# Altium schematic sheet Debug_Flash.SchDoc
size A3; SheetNumber: 9; SheetTotal: 10
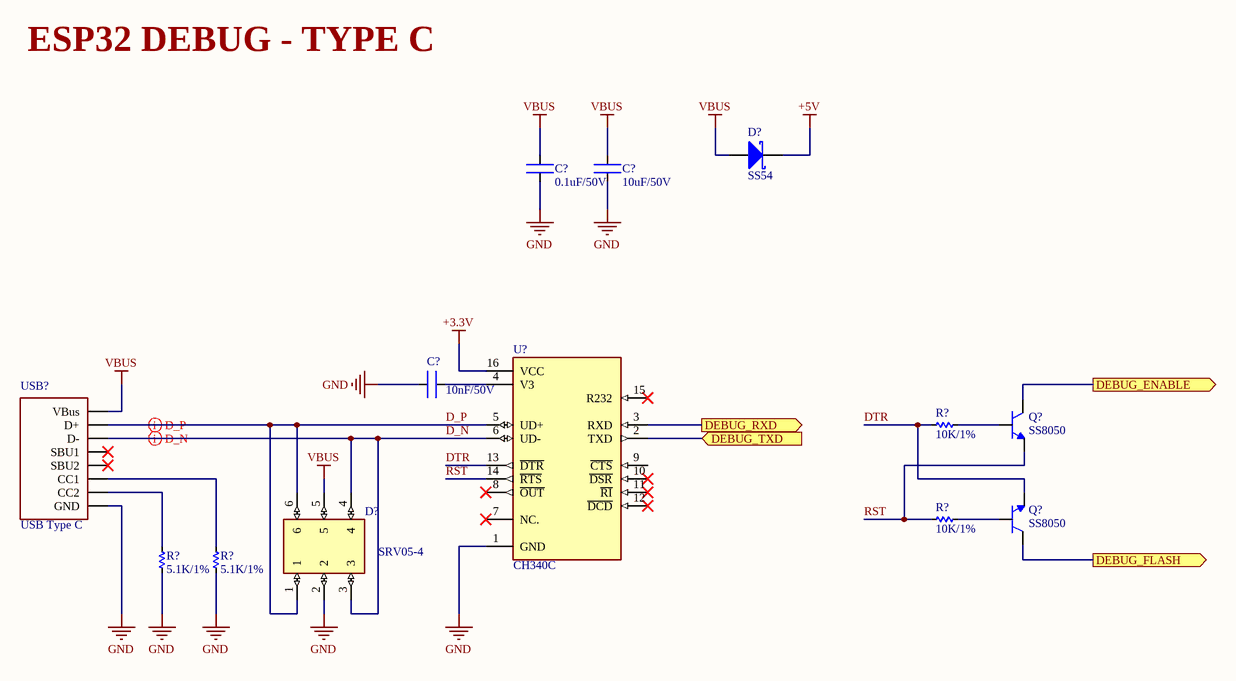
[diagram p0: Debug_Flash.SchDoc]

## Parts
(Parts that share a designator on the sheet are numbered #1, #2 ... from top to bottom, then left to right.)
C?#1  0.1uF/50V  [CAP - 0603]
C?#2  10uF/50V  [CAP - 0603]
C?#3  10nF/50V  [CAP - 0603]
D?#1  SS54  [SS54]
D?#2  SRV05-4  [SOT-23-6]
Q?#1  SS8050  [SOT23-3]
Q?#2  SS8050  [SOT23-3]
R?#1  10K/1%  [RES - 2512]
R?#2  10K/1%  [RES - 2512]
R?#3  5.1K/1%  [RES - 2512]
R?#4  5.1K/1%  [RES - 2512]
U?  CH340C  [SOIC127P600X180-16N]
USB?  USB Type C  [Type-C-16Pins]

## Ports
DEBUG_ENABLE (out), DEBUG_FLASH (out), DEBUG_RXD (out), DEBUG_TXD (in)

## Nets
+3.3V: U?.16(VCC)
+5V: D?#1.2(K)
GND: C?#1.1 C?#2.1 C?#3.1 D?#2.2 R?#3.2 R?#4.2 U?.1(GND) USB?.A1,A12,B1,B12,SHIELD(GND)
VBUS: C?#1.2 C?#2.2 D?#1.1(A) D?#2.5 USB?.A4,A9,B4,B9(VBus)
D_N: D?#2.3 D?#2.4 U?.6(UD-) USB?.A7,B7(D-)
D_P: D?#2.1 D?#2.6 U?.5(UD+) USB?.A6,B6(D+)
DEBUG_ENABLE: Q?#1.3(C) ; port DEBUG_ENABLE
DEBUG_FLASH: Q?#2.3(C) ; port DEBUG_FLASH
DEBUG_RXD: U?.3(RXD) ; port DEBUG_RXD
DEBUG_TXD: U?.2(TXD) ; port DEBUG_TXD
DTR: Q?#2.2(E) R?#1.1 U?.13(~{DTR})
RST: Q?#1.2(E) R?#2.1 U?.14(~{RTS})
NetC?#3_2: C?#3.2 U?.4(V3)
NetQ?#1_1: Q?#1.1(B) R?#1.2
NetQ?#2_1: Q?#2.1(B) R?#2.2
NetR?#3_1: R?#3.1 USB?.B5(CC2)
NetR?#4_1: R?#4.1 USB?.A5(CC1)

Not connected (* = marked no-connect by the designer): U? 7(NC.)* 8(~{OUT})* 9(~{CTS}) 10(~{DSR})* 11(~{RI})* 12(~{DCD})* 15(R232)*; USB? A8(SBU1)* B8(SBU2)*

## Layout directives
differential pair: D_N, D_P

## Notes on the sheet
- ESP32 DEBUG - TYPE C

## Library data of the parts
C?#1-C?#3 = CAPACITOR: CAPACITOR SMD - KEMET
D?#1 = SS54: DIODE SCHOTTKY 40V 5A SMA; Supplier 1: Newark; Supplier Part Number 1: 08X3002
D?#2 = SRV05-4: 17.5V Clamp 12A (8/20µs) Ipp Tvs Diode Surface Mount SOT-23-6
Q?#1 Q?#2 = SS8050: Bipolar (BJT) Transistor NPN 25 V 1.5 A 100MHz 300 mW Surface Mount SOT-23-3
R?#1-R?#4 = RESISTOR: Resistor SMD - YAGEO
U? = CH340C: USB to serial chip CH340